# Altium schematic sheet Relay_module.SchDoc: Relays_module
size A3; Date: 2018/10/8; Author: Wang Peirong; Revision: V1.1; SheetNumber: 5; SheetTotal: Light relays and horn relay; Size: A3; Pages: 6
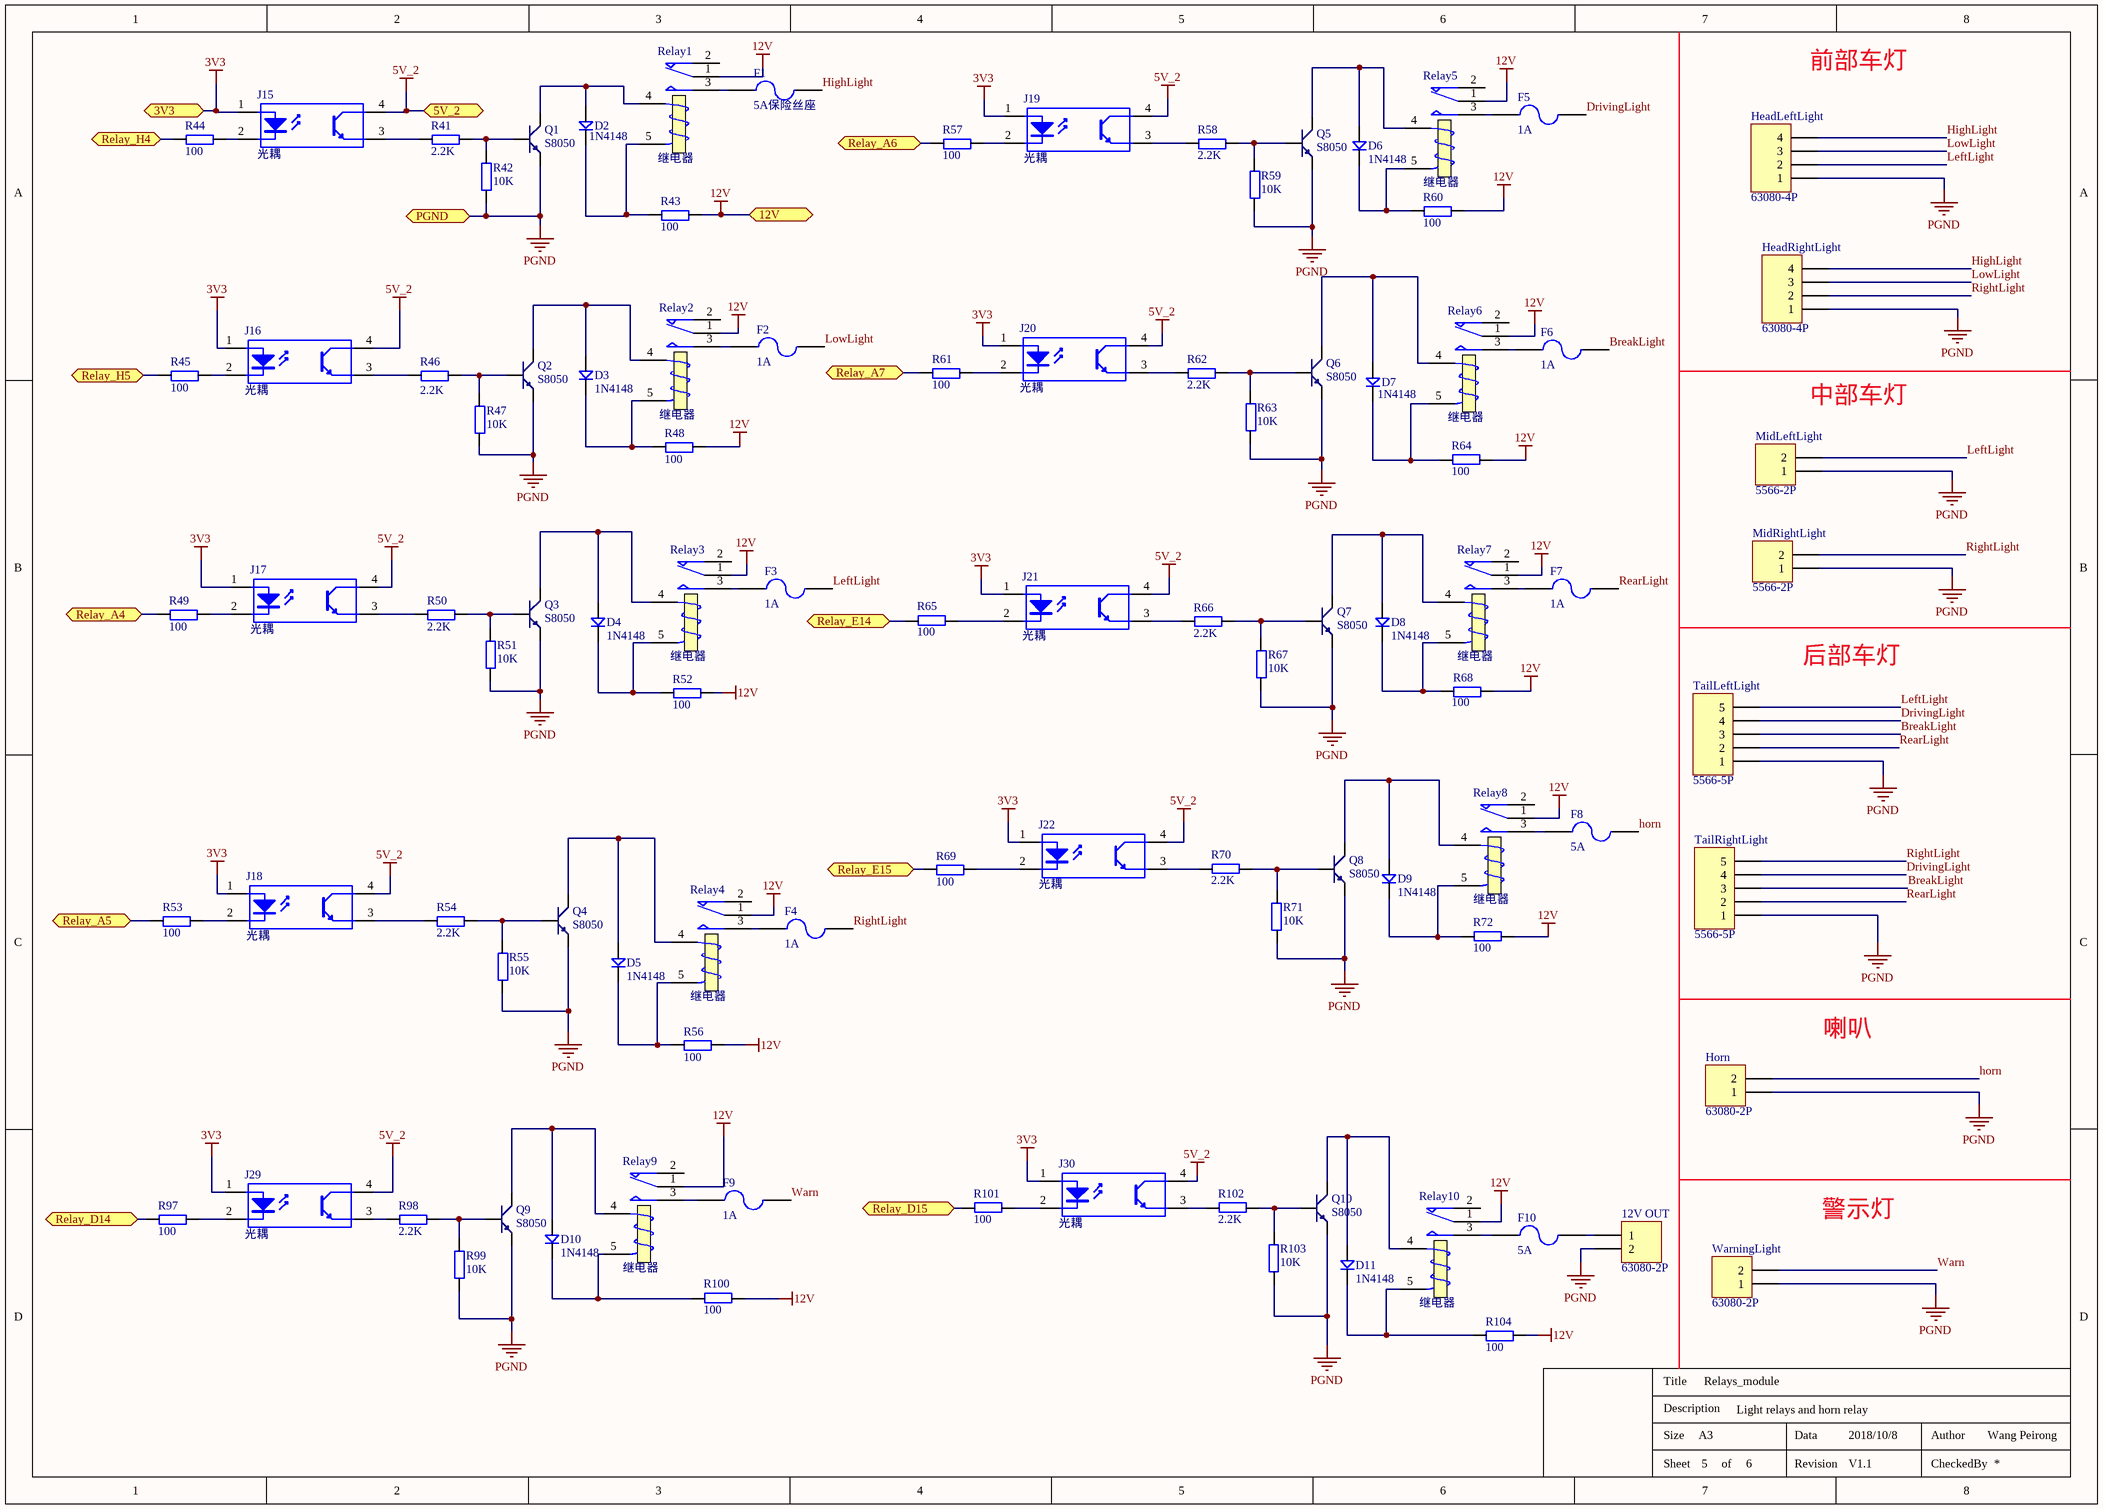
[diagram p0: Relay_module.SchDoc]

## Parts
12V_OUT  63080-2P  [63038-2P]
D2  1N4148  [DIODE_SOP]
D3  1N4148  [DIODE_SOP]
D4  1N4148  [DIODE_SOP]
D5  1N4148  [DIODE_SOP]
D6  1N4148  [DIODE_SOP]
D7  1N4148  [DIODE_SOP]
D8  1N4148  [DIODE_SOP]
D9  1N4148  [DIODE_SOP]
D10  1N4148  [DIODE_SOP]
D11  1N4148  [DIODE_SOP]
F1  value 5A保险丝座  [汽车保险丝座子]  (hidden comment: 5A)
F2  value 1A  [汽车保险丝座子]  (hidden comment: 5A保险丝座)
F3  value 1A  [汽车保险丝座子]  (hidden comment: 5A保险丝座)
F4  value 1A  [汽车保险丝座子]  (hidden comment: 5A保险丝座)
F5  value 1A  [汽车保险丝座子]  (hidden comment: 5A保险丝座)
F6  value 1A  [汽车保险丝座子]  (hidden comment: 5A保险丝座)
F7  value 1A  [汽车保险丝座子]  (hidden comment: 5A保险丝座)
F8  value 5A  [汽车保险丝座子]  (hidden comment: 5A保险丝座)
F9  value 1A  [汽车保险丝座子]  (hidden comment: 5A保险丝座)
F10  value 5A  [汽车保险丝座子]  (hidden comment: 5A保险丝座)
HeadLeftLight  63080-4P  [63080-4P]
HeadRightLight  63080-4P  [63080-4P]
Horn  63080-2P  [63038-2P]
J15  光耦  [SOP127P710X350-4N]
J16  光耦  [SOP127P710X350-4N]
J17  光耦  [SOP127P710X350-4N]
J18  光耦  [SOP127P710X350-4N]
J19  光耦  [SOP127P710X350-4N]
J20  光耦  [SOP127P710X350-4N]
J21  光耦  [SOP127P710X350-4N]
J22  光耦  [SOP127P710X350-4N]
J29  光耦  [SOP127P710X350-4N]
J30  光耦  [SOP127P710X350-4N]
MidLeftLight  5566-2P  [5566-2P]
MidRightLight  5566-2P  [5566-2P]
Q1  S8050  [SOT-23R]
Q2  S8050  [SOT-23R]
Q3  S8050  [SOT-23R]
Q4  S8050  [SOT-23R]
Q5  S8050  [SOT-23R]
Q6  S8050  [SOT-23R]
Q7  S8050  [SOT-23R]
Q8  S8050  [SOT-23R]
Q9  S8050  [SOT-23R]
Q10  S8050  [SOT-23R]
R41  2.2K  [0603P]
R42  10K  [0603P]
R43  100  [0603P]
R44  100  [0603P]
R45  100  [0603P]
R46  2.2K  [0603P]
R47  10K  [0603P]
R48  100  [0603P]
R49  100  [0603P]
R50  2.2K  [0603P]
R51  10K  [0603P]
R52  100  [0603P]
R53  100  [0603P]
R54  2.2K  [0603P]
R55  10K  [0603P]
R56  100  [0603P]
R57  100  [0603P]
R58  2.2K  [0603P]
R59  10K  [0603P]
R60  100  [0603P]
R61  100  [0603P]
R62  2.2K  [0603P]
R63  10K  [0603P]
R64  100  [0603P]
R65  100  [0603P]
R66  2.2K  [0603P]
R67  10K  [0603P]
R68  100  [0603P]
R69  100  [0603P]
R70  2.2K  [0603P]
R71  10K  [0603P]
R72  100  [0603P]
R97  100  [0603P]
R98  2.2K  [0603P]
R99  10K  [0603P]
R100  100  [0603P]
R101  100  [0603P]
R102  2.2K  [0603P]
R103  10K  [0603P]
R104  100  [0603P]
Relay1  继电器  [SRD-12VDC]
Relay2  继电器  [SRD-12VDC]
Relay3  继电器  [SRD-12VDC]
Relay4  继电器  [SRD-12VDC]
Relay5  继电器  [SRD-12VDC]
Relay6  继电器  [SRD-12VDC]
Relay7  继电器  [SRD-12VDC]
Relay8  继电器  [SRD-12VDC]
Relay9  继电器  [SRD-12VDC]
Relay10  继电器  [SRD-12VDC]
TailLeftLight  5566-5P  [5566-5P]
TailRightLight  5566-5P  [5566-5P]
WarningLight  63080-2P  [63038-2P]

## Ports
3V3, 5V_2, 12V, PGND, Relay_A4, Relay_A5, Relay_A6, Relay_A7, Relay_D14, Relay_D15, Relay_E14, Relay_E15, Relay_H4, Relay_H5

## Nets
3V3: J15.1(A) J16.1(A) J17.1(A) J18.1(A) J19.1(A) J20.1(A) J21.1(A) J22.1(A) J29.1(A) J30.1(A) ; port 3V3
5V_2: J15.4(C) J16.4(C) J17.4(C) J18.4(C) J19.4(C) J20.4(C) J21.4(C) J22.4(C) J29.4(C) J30.4(C) ; port 5V_2
12V: R43.2 R48.2 R52.2 R56.2 R60.2 R64.1 R68.2 R72.1 R100.1 R104.2 Relay1.1(COM) Relay2.1(COM) Relay3.1(COM) Relay4.1(COM) Relay5.1(COM) Relay6.1(COM) Relay7.1(COM) Relay8.1(COM) Relay9.1(COM) Relay10.1(COM) ; port 12V
PGND: 12V_OUT.2 HeadLeftLight.1 HeadRightLight.1 Horn.1 MidLeftLight.1 MidRightLight.1 Q1.1(E) Q2.1(E) Q3.1(E) Q4.1(E) Q5.1(E) Q6.1(E) Q7.1(E) Q8.1(E) Q9.1(E) Q10.1(E) R42.1 R47.1 R51.1 R55.1 R59.1 R63.1 R67.1 R71.2 R99.1 R103.2 TailLeftLight.1 TailRightLight.1 WarningLight.1 ; port PGND
BreakLight: F6.2 TailLeftLight.3 TailRightLight.3
DrivingLight: F5.2 TailLeftLight.4 TailRightLight.4
HighLight: F1.2 HeadLeftLight.4 HeadRightLight.4
horn: F8.2 Horn.2
LeftLight: F3.2 HeadLeftLight.2 MidLeftLight.2 TailLeftLight.5
LowLight: F2.2 HeadLeftLight.3 HeadRightLight.3
RearLight: F7.2 TailLeftLight.2 TailRightLight.2
Relay_A4: R49.1 ; port Relay_A4
Relay_A5: R53.1 ; port Relay_A5
Relay_A6: R57.1 ; port Relay_A6
Relay_A7: R61.1 ; port Relay_A7
Relay_D14: R97.1 ; port Relay_D14
Relay_D15: R101.2 ; port Relay_D15
Relay_E14: R65.2 ; port Relay_E14
Relay_E15: R69.1 ; port Relay_E15
Relay_H4: R44.1 ; port Relay_H4
Relay_H5: R45.1 ; port Relay_H5
RightLight: F4.2 HeadRightLight.2 MidRightLight.2 TailRightLight.5
Warn: F9.2 WarningLight.2
Net12V_OUT_1: 12V_OUT.1 F10.2
NetD2_1: D2.1 Q1.3(C) Relay1.4(T1)
NetD2_2: D2.2 R43.1 Relay1.5(T2)
NetD3_1: D3.1 Q2.3(C) Relay2.4(T1)
NetD3_2: D3.2 R48.1 Relay2.5(T2)
NetD4_1: D4.1 Q3.3(C) Relay3.4(T1)
NetD4_2: D4.2 R52.1 Relay3.5(T2)
NetD5_1: D5.1 Q4.3(C) Relay4.4(T1)
NetD5_2: D5.2 R56.1 Relay4.5(T2)
NetD6_1: D6.1 Q5.3(C) Relay5.4(T1)
NetD6_2: D6.2 R60.1 Relay5.5(T2)
NetD7_1: D7.1 Q6.3(C) Relay6.4(T1)
NetD7_2: D7.2 R64.2 Relay6.5(T2)
NetD8_1: D8.1 Q7.3(C) Relay7.4(T1)
NetD8_2: D8.2 R68.1 Relay7.5(T2)
NetD9_1: D9.1 Q8.3(C) Relay8.4(T1)
NetD9_2: D9.2 R72.2 Relay8.5(T2)
NetD10_1: D10.1 Q9.3(C) Relay9.4(T1)
NetD10_2: D10.2 R100.2 Relay9.5(T2)
NetD11_1: D11.1 Q10.3(C) Relay10.4(T1)
NetD11_2: D11.2 R104.1 Relay10.5(T2)
NetF1_1: F1.1 Relay1.3(NO)
NetF2_1: F2.1 Relay2.3(NO)
NetF3_1: F3.1 Relay3.3(NO)
NetF4_1: F4.1 Relay4.3(NO)
NetF5_1: F5.1 Relay5.3(NO)
NetF6_1: F6.1 Relay6.3(NO)
NetF7_1: F7.1 Relay7.3(NO)
NetF8_1: F8.1 Relay8.3(NO)
NetF9_1: F9.1 Relay9.3(NO)
NetF10_1: F10.1 Relay10.3(NO)
NetJ15_2: J15.2(K) R44.2
NetJ15_3: J15.3(E) R41.1
NetJ16_2: J16.2(K) R45.2
NetJ16_3: J16.3(E) R46.1
NetJ17_2: J17.2(K) R49.2
NetJ17_3: J17.3(E) R50.1
NetJ18_2: J18.2(K) R53.2
NetJ18_3: J18.3(E) R54.1
NetJ19_2: J19.2(K) R57.2
NetJ19_3: J19.3(E) R58.1
NetJ20_2: J20.2(K) R61.2
NetJ20_3: J20.3(E) R62.1
NetJ21_2: J21.2(K) R65.1
NetJ21_3: J21.3(E) R66.1
NetJ22_2: J22.2(K) R69.2
NetJ22_3: J22.3(E) R70.2
NetJ29_2: J29.2(K) R97.2
NetJ29_3: J29.3(E) R98.1
NetJ30_2: J30.2(K) R101.1
NetJ30_3: J30.3(E) R102.2
NetQ1_2: Q1.2(B) R41.2 R42.2
NetQ2_2: Q2.2(B) R46.2 R47.2
NetQ3_2: Q3.2(B) R50.2 R51.2
NetQ4_2: Q4.2(B) R54.2 R55.2
NetQ5_2: Q5.2(B) R58.2 R59.2
NetQ6_2: Q6.2(B) R62.2 R63.2
NetQ7_2: Q7.2(B) R66.2 R67.2
NetQ8_2: Q8.2(B) R70.1 R71.1
NetQ9_2: Q9.2(B) R98.2 R99.2
NetQ10_2: Q10.2(B) R102.1 R103.1

Not connected (* = marked no-connect by the designer): Relay1 2(NC); Relay2 2(NC); Relay3 2(NC); Relay4 2(NC); Relay5 2(NC); Relay6 2(NC); Relay7 2(NC); Relay8 2(NC); Relay9 2(NC); Relay10 2(NC)

## Notes on the sheet
- 前部车灯
- 中部车灯
- 后部车灯
- 喇叭
- 警示灯
- Title
- Description
- Size
- Data
- Author
- Sheet
- of
- Revision
- CheckedBy

## Library data of the parts
12V_OUT Horn MidLeftLight MidRightLight WarningLight = Header 2: Header, 2-Pin; LatestRevisionDate: 17-Jul-2002; LatestRevisionNote: Re-released for DXP Platform.; Publisher: Altium Limited
D2-D11 = D
F1-F10 = 保险丝: Published: 8-Jun-2000; LatestRevisionDate: 17-Jul-2002; LatestRevisionNote: Re-released for DXP Platform.; PackageReference: PIN-W2/E2.8; Publisher: Altium Limited
HeadLeftLight HeadRightLight = Header 4: Header, 4-Pin; LatestRevisionDate: 17-Jul-2002; LatestRevisionNote: Re-released for DXP Platform.; Publisher: Altium Limited
Q1-Q10 = NPN: 8050/BCW846/BCW847
R41-R72 R97-R104 = R
TailLeftLight TailRightLight = Header 5: Header, 5-Pin; LatestRevisionDate: 17-Jul-2002; LatestRevisionNote: Re-released for DXP Platform.; Publisher: Altium Limited
J15-J22 J29 J30 = 光耦: Published: 24-Mar-1999; LatestRevisionDate: 04-Mar-2005; LatestRevisionNote: Sch pins 3 & 4 Swapped.; DatasheetDocument: Nov-2003; PackageReference: DIP-4; Publisher: Altium Limited